# EAGLE design DoorLock (EAGLE 5.06)
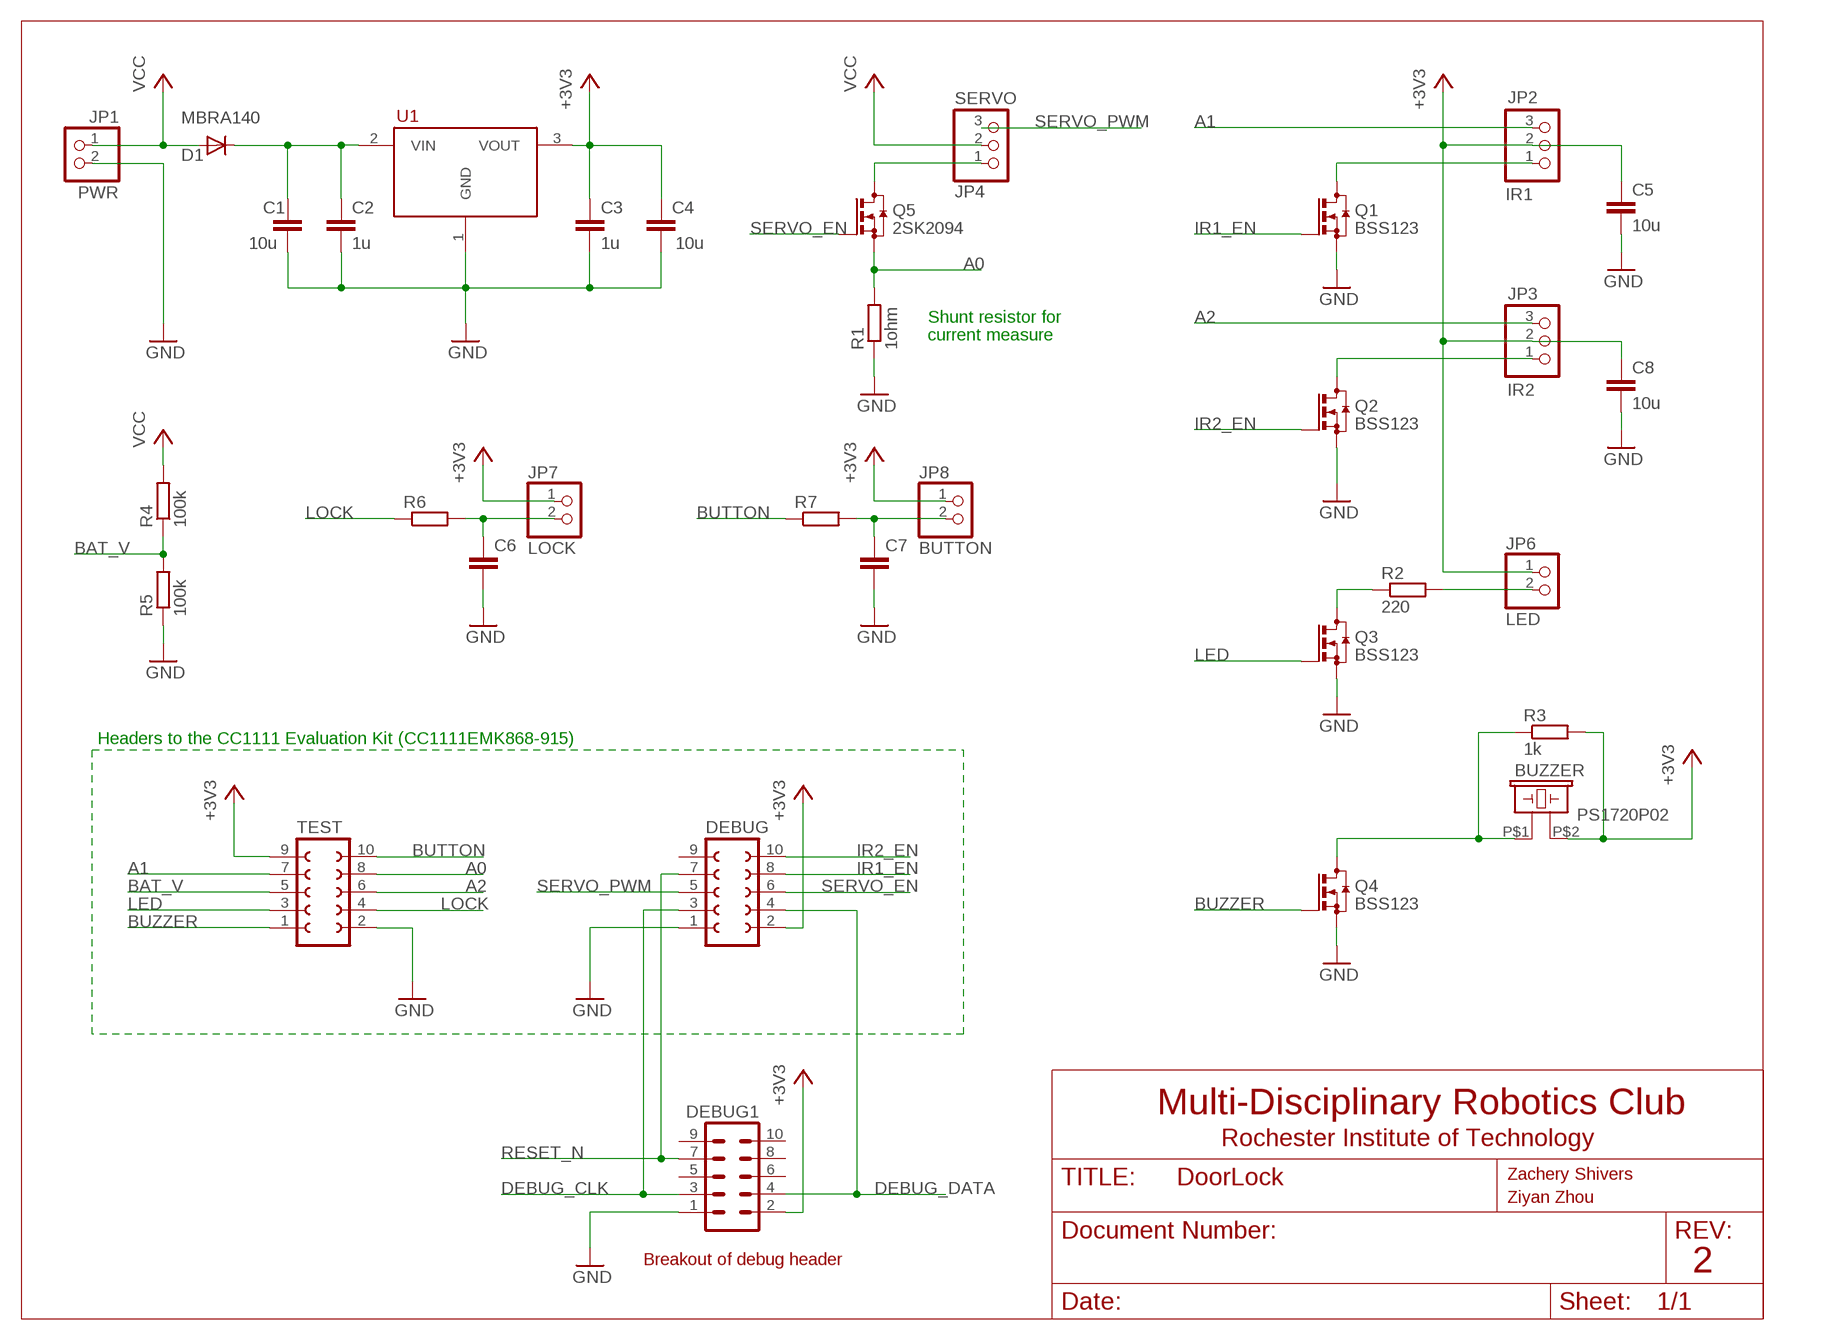
[diagram p0: schematic, sheet 1]

## Parts
BUZZER  PS1720P02  [PS1720P02]
C1  10u  C-EUC1210  [C1210]
C2  1u  C-EUC0805  [C0805]
C3  1u  C-EUC0805  [C0805]
C4  10u  C-EUC1210  [C1210]
C5  10u  C-EUC1210  [C1210]
C6  C-EUC0805  [C0805]
C7  C-EUC0805  [C0805]
C8  10u  C-EUC1210  [C1210]
D1  MBRA140  DIODESMA  [SMA-DIODE]
DEBUG  FE05-2  [FE05-2]
DEBUG1  MA05-2  [MA05-2]
JP1  PWR  PINHD-1X2  [1X02]
JP2  IR1  PINHD-1X3  [1X03]
JP3  IR2  PINHD-1X3  [1X03]
JP4  SERVO  PINHD-1X3  [1X03]
JP6  LED  PINHD-1X2  [1X02]
JP7  LOCK  PINHD-1X2  [1X02]
JP8  BUTTON  PINHD-1X2  [1X02]
Q1  BSS123  [SOT23]
Q2  BSS123  [SOT23]
Q3  BSS123  [SOT23]
Q4  BSS123  [SOT23]
Q5  2SK2094  [TO-252]
R1  1ohm  R-EU_  [5W-RESISTOR]
R2  220  R-EU_R0805  [R0805]
R3  1k  R-EU_R0805  [R0805]
R4  100k  R-EU_R0805  [R0805]
R5  100k  R-EU_R0805  [R0805]
R6  R-EU_R0805  [R0805]
R7  R-EU_R0805  [R0805]
TEST  FE05-2  [FE05-2]
U1  MCP1702  [TO92-]

## Nets
+3V3: BUZZER.P$2 C3.1 C4.2 C5.2 C8.2 DEBUG1.2 DEBUG.2 JP2.2 JP3.2 JP6.1 JP7.1 JP8.1 R3.2 TEST.9 U1.3(VOUT)
A0: Q5.3(S) R1.2 TEST.8
A1: JP2.3 TEST.7
A2: JP3.3 TEST.6
BAT_V: R4.1 R5.2 TEST.5
BUTTON: R7.1 TEST.10
BUZZER: Q4.1(G) TEST.1
DEBUG_CLK: DEBUG1.3 DEBUG.3
DEBUG_DATA: DEBUG1.4 DEBUG.4
GND: C1.1 C2.2 C3.2 C4.1 C5.1 C6.2 C7.2 C8.1 DEBUG1.1 DEBUG.1 JP1.2 Q1.2(S) Q2.2(S) Q3.2(S) Q4.2(S) R1.1 R5.1 TEST.2 U1.1(GND)
IR1_EN: DEBUG.8 Q1.1(G)
IR2_EN: DEBUG.10 Q2.1(G)
LED: Q3.1(G) TEST.3
LOCK: R6.1 TEST.4
N$1: JP4.1 Q5.2(D)
N$3: JP2.1 Q1.3(D)
N$5: C1.2 C2.1 D1.C U1.2(VIN)
N$7: JP3.1 Q2.3(D)
N$8: C7.1 JP8.2 R7.2
N$9: JP6.2 R2.2
N$10: Q3.3(D) R2.1
N$11: C6.1 JP7.2 R6.2
N$12: BUZZER.P$1 Q4.3(D) R3.1
RESET_N: DEBUG1.7 DEBUG.7
SERVO_EN: DEBUG.6 Q5.1(G)
SERVO_PWM: DEBUG.5 JP4.3
VCC: D1.A JP1.1 JP4.2 R4.2
Unconnected: DEBUG1.5 DEBUG1.6 DEBUG1.8 DEBUG1.9 DEBUG1.10 DEBUG.9

## Notes on the sheet
- Shunt resistor for
- current measure
- Headers to the CC1111 Evaluation Kit (CC1111EMK868-915)
- Multi-Disciplinary Robotics Club
- Rochester Institute of Technology
- Zachery Shivers
- Ziyan Zhou
- Breakout of debug header
- 2

## Library data of the parts
BUZZER = buzzer:PS1720P02
C1-C8 = resistor:C-EU: CAPACITOR, European symbol
D1 = SparkFun-Nate:DIODE
DEBUG TEST = con-lsta:FE05-2: FEMALE HEADER
DEBUG1 = con-lstb:MA05-2: PIN HEADER
JP1 JP6-JP8 = pinhead:PINHD-1X2: PIN HEADER
JP2-JP4 = pinhead:PINHD-1X3: PIN HEADER
Q1-Q4 = transistor-small-signal:BSS123: N-CHANNEL MOS FET
Q5 = doorlock-parts:2SK2094: N-CHANNEL MOS FET
R1 = doorlock-parts:R-EU_: RESISTOR, European symbol
R2-R7 = resistor:R-EU_: RESISTOR, European symbol
U1 = doorlock-parts:MCP1702

## Board
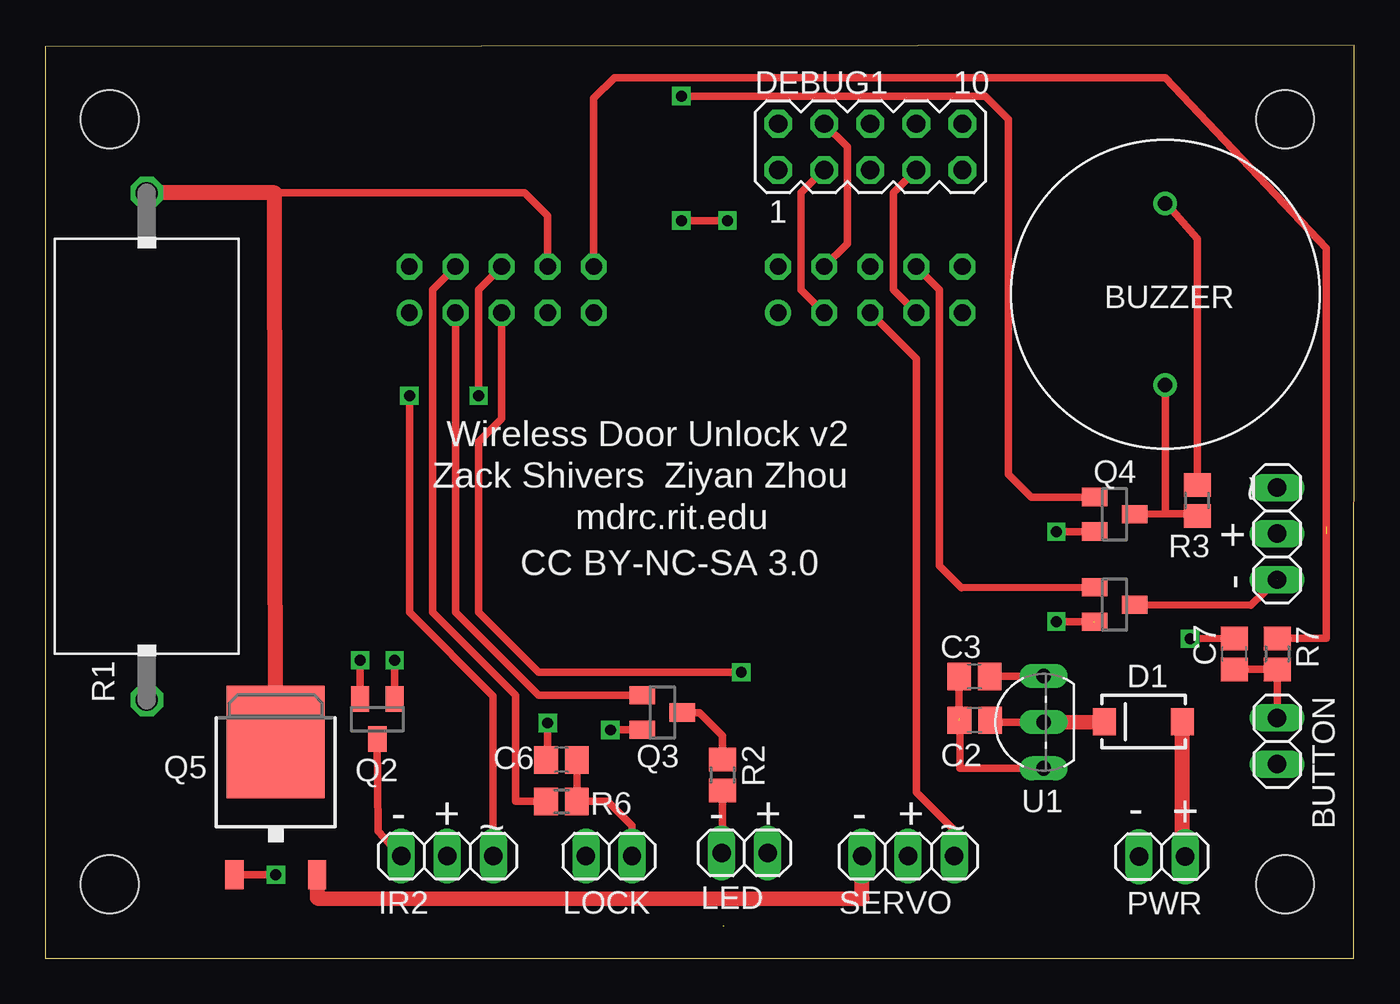
[diagram p1: board, top side]
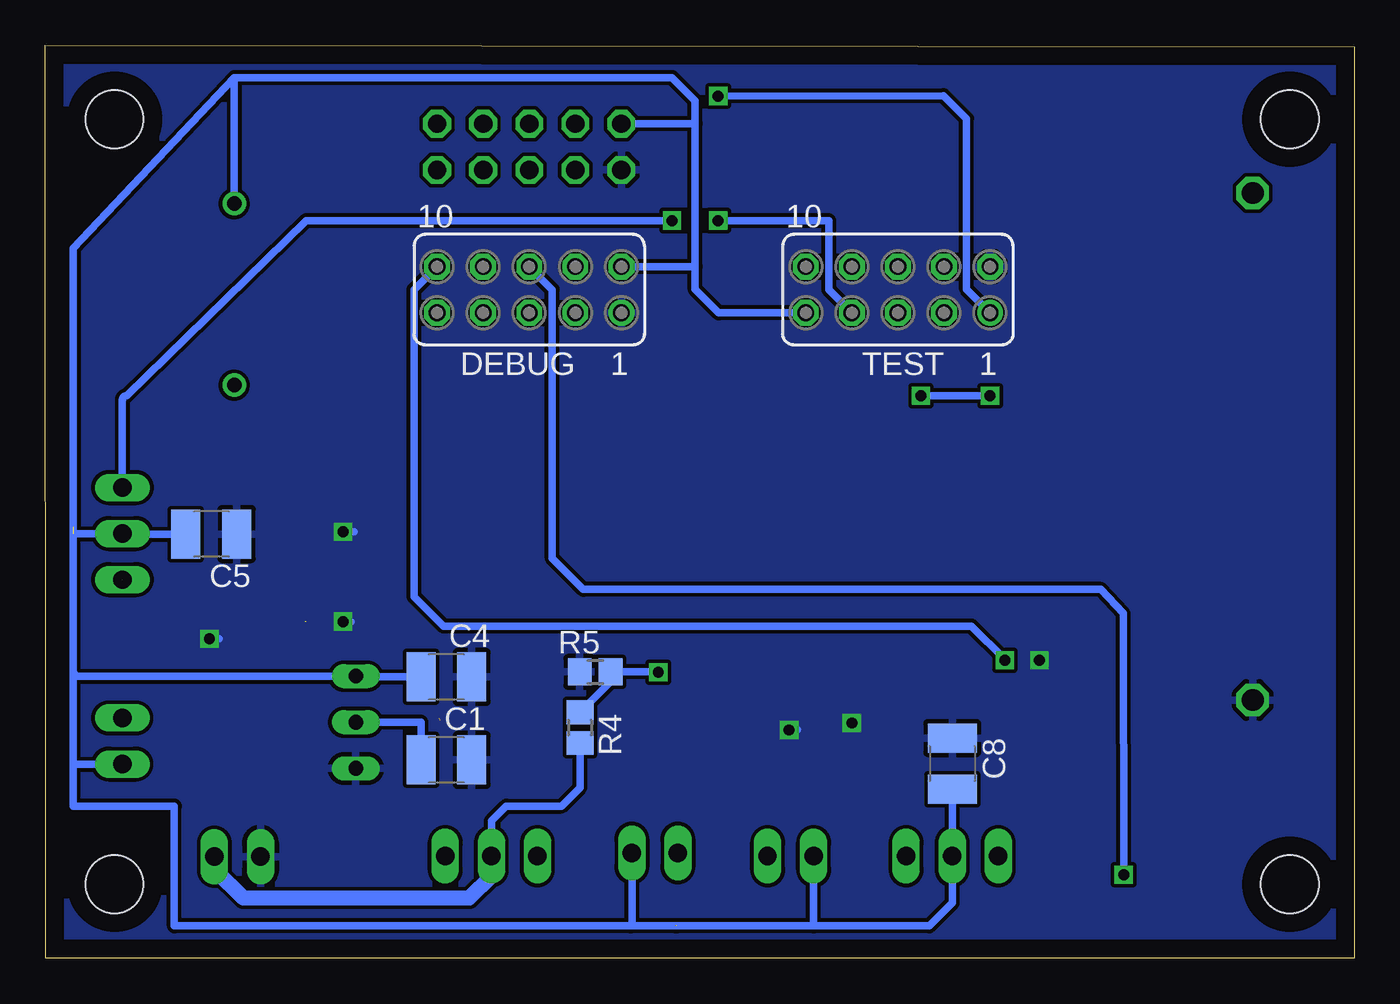
[diagram p2: board, bottom side, seen from below]

Size 72.14 x 50.29 mm. Coordinates in mm from the lower left corner, seen from the top.
Outline: 0,0 72.12,0 72.14,50.29 0,50.22 0,0
Copper layers (1*16): Top 0.035mm / dielectric 1.5mm / Bottom 0.035mm
Design rules "default *": minimum track width 10mil, minimum drill 12mil, track to track 8mil, track to pad 8mil, pad to pad 8mil, via to via 8mil, smd to smd 8mil, copper to edge 40mil, drill to drill 8mil, minimum pad ring 10mil, minimum via ring 8mil, stop-mask expansion 4mil, vias tented up to drill 0mil, thermal gap 10mil
Holes 3.2 mm at 68.33,4.06 68.33,46.23 3.56,46.23 3.56,4.06

### Footprints (pad centres in the part's own frame; a part is rotated, then mirrored left to right if it is on the bottom)
PS1720P02 = drill 0.8 round: P$1 -5,0; P$2 5,0
C1210 = smd 1.6 x 2.7: 1 -1.4,0; 2 1.4,0
C0805 = smd 1.3 x 1.5: 1 -0.85,0; 2 0.85,0
SMA-DIODE = smd 1.27 x 1.47: A -2.15,0; C 2.15,0
FE05-2 = drill 0.914 round: 1 -5.08,1.27 | drill 0.914 octagon: 2 -5.08,-1.27; 3 -2.54,1.27; 4 -2.54,-1.27; 5 0,1.27; 6 0,-1.27; 7 2.54,1.27; 8 2.54,-1.27; 9 5.08,1.27; 10 5.08,-1.27
MA05-2 = drill 1.016 octagon: 1 -5.08,-1.27; 2 -5.08,1.27; 3 -2.54,-1.27; 4 -2.54,1.27; 5 0,-1.27; 6 0,1.27; 7 2.54,-1.27; 8 2.54,1.27; 9 5.08,-1.27; 10 5.08,1.27
1X02 = drill 1.016 long: 1 -1.27,0; 2 1.27,0
1X03 = drill 1.016 long: 1 -2.54,0; 2 0,0; 3 2.54,0
SOT23 = smd 1 x 1.4: 1 -0.95,-1.1; 2 0.95,-1.1; 3 0,1.1
TO-252 = smd 1 x 1.6: 1 -2.28,-6.07; 2 2.28,-6.07 | smd 5.4 x 6.2: 3 0,1.23
5W-RESISTOR = drill 1.194 octagon: 1 -13.97,0; 2 13.97,0
R0805 = smd 1.3 x 1.5: 1 -0.85,0; 2 0.85,0
TO92- = drill 0.813 long: 1 -2.54,0; 2 0,0; 3 2.54,0

### Placement (x,y rotation side)
BUZZER  61.72,36.58 90 top
C1  50.04,10.92 180 bottom
C2  51.23,13.11 180 top
C3  51.21,15.52 180 top
C4  50.04,15.49 180 bottom
C5  62.99,23.37 180 bottom
C6  28.45,10.92 180 top
C7  65.53,16.76 90 top
C8  22.15,10.72 270 bottom
D1  60.53,13.03 180 top
DEBUG  45.47,36.83 180 bottom
DEBUG1  45.47,44.7 0 top
JP1  61.55,5.59 180 top
JP2  67.89,23.39 90 top
JP3  22.15,5.62 0 top
JP4  47.55,5.62 0 top
JP6  38.54,5.8 180 top
JP7  31.06,5.62 0 top
JP8  67.89,11.96 90 top
Q1  58.93,19.48 270 top
Q2  18.3,13.18 180 top
Q3  34.01,13.53 270 top
Q4  58.93,24.46 270 top
Q5  12.7,10.67 0 top
R1  5.59,28.19 90 top
R2  37.32,10.09 270 top
R3  63.49,25.22 90 top
R4  42.67,12.7 270 bottom
R5  41.83,15.77 0 bottom
R6  28.45,8.64 0 top
R7  67.89,16.76 270 top
TEST  25.15,36.83 180 bottom
U1  55.02,13 90 top

### Tracks (layer width: path | path; a pad name or v marks a point on that pad's centre or on a via)
+3V3  (2 unrouted)
  Top 0.406: U1.3 52.08,15.54 C3.1 | R3.2 63.5,39.62 61.72,41.66 BUZZER.P$2
  Bottom 0.406: 61.72,48.51 BUZZER.P$2 | 61.72,48.51 37.59,48.51 36.32,47.24 36.32,45.97 | 70.61,15.75 70.61,23.77 | 29.79,1.78 23.42,1.78 22.15,3.05 JP3.2 C8.2 | 29.79,1.78 JP7.1 | 29.79,1.78 37.34,1.78 | 37.4,1.78 39.88,1.78 | 39.88,1.78 65.02,1.78 65.02,8.38 70.61,8.38 70.61,10.67 | 70.61,10.67 70.61,15.75 | 70.61,15.75 70.4,15.54 U1.3 55.02,15.49 C4.2 | 61.72,48.51 70.61,39.12 70.61,23.39 JP2.2 67.86,23.37 C5.2 | JP8.1 70.59,10.69 70.61,10.67 | TEST.9 35.03,35.56 36.32,36.85 36.32,38.1 | 36.32,38.1 DEBUG.2 | JP6.1 39.81,1.84 39.88,1.78 | 36.32,38.1 36.32,45.97 | 36.32,45.97 DEBUG1.2
A0
  Top 0.406: Q5.3 11.18,11.18 12.95,11.18 | 12.65,42.16 26.42,42.16 27.69,40.89 TEST.8
  Top 0.813: R1.2 12.65,42.16 Q5.3
A1  (via drill 0.6)
  Top 0.406: v35.05,40.64 v37.59,40.64
  Bottom 0.406: v37.59,40.64 57.75,40.64 67.66,30.99 arc-90 67.89,30.76 JP2.3 | v35.05,40.64 28.96,40.64 28.96,36.83 TEST.7
A2  (via drill 0.6)
  Top 0.406: 24.64,5.62 JP3.3 24.69,14.43 20.07,19.05 v20.07,30.99 | TEST.6 23.88,36.83 v23.88,30.99
  Bottom 0.406: v20.07,30.99 v23.88,30.99
BAT_V  (via drill 0.6)
  Top 0.406: TEST.5 25.15,29.72 23.88,28.45 23.88,19.05 27.18,15.75 v38.35,15.75
  Bottom 0.406: R4.1 40.98,15.24 R5.2 38.38,15.77 v38.35,15.75
BUTTON
  Top 0.406: TEST.10 30.23,47.38 31.36,48.51 61.72,48.51 70.61,39.12 70.61,17.61 R7.1
BUZZER  (via drill 0.6)
  Top 0.406: v35.05,47.5 51.82,47.5 53.09,46.23 53.09,26.67 54.36,25.4 57.75,25.4 Q4.1
  Bottom 0.406: v35.05,47.5 22.63,47.52 21.36,46.25 21.36,36.85 TEST.1
DEBUG_CLK
  Top 0.406: DEBUG.3 41.66,36.83 41.66,42.16 DEBUG1.3
DEBUG_DATA
  Top 0.406: DEBUG.4 44.2,39.37 44.2,44.7 DEBUG1.4
GND  (via drill 0.6)  (2 unrouted)
  Top 0.406: C3.2 50.36,13.89 C2.2 | Q4.2 57.84,23.5 v55.73,23.5 | v63.09,17.6 C7.2 | v55.73,18.54 57.76,18.54 | U1.1 50.39,10.46 50.39,13.21 | Q2.2 | Q2.2 v17.35,16.41 | C6.2 27.69,11.01 v27.69,12.95 | v31.14,12.57 31.9,12.58 Q3.2
  Bottom 0.406: v55.73,23.5 55.12,23.5 | v31.14,12.57 30.68,12.57 | v63.09,17.6 62.56,17.6 | v55.73,18.54 55.3,18.54 | v27.69,12.95 27.69,13.21
  pour Bottom: 0.25,0.25 0.25,50.04 71.88,50.04 71.88,0.25
IR1_EN
  Top 0.406: DEBUG.8 49.28,36.83 49.28,21.61 50.48,20.41 Q1.1
IR2_EN  (via drill 0.6)
  Top 0.406: v19.25,16.41 v19.25,16.4 Q2.1
  Bottom 0.406: DEBUG.10 51.82,36.83 51.82,19.91 50.19,18.29 21.08,18.29 19.25,16.46 v19.25,16.41
LED
  Top 0.406: TEST.3 22.61,19.06 27.18,14.49 27.18,14.48 32,14.48 Q3.1
LOCK
  Top 0.406: TEST.4 21.34,36.83 21.34,19.05 25.91,14.48 25.91,8.64 R6.1
N$1
  Top 0.813: Q5.2 14.98,3.3 45.01,3.28 JP4.1
N$3  (1 unrouted)
  Top 0.406: Q1.3 66.44,19.45 JP2.1
N$5
  Top 0.406: U1.2 52.48,13 C2.1
  Top 0.813: U1.2 D1.C
  Bottom 0.406: C1.2 51.43,13 U1.2
N$7
  Top 0.406: JP3.1 18.34,7 Q2.3
N$8
  Top 0.406: JP8.2 R7.2 C7.1
N$9
  Top 0.406: R2.2 37.32,5.8 JP6.2
N$10
  Top 0.406: 37.34,11.2 R2.1 37.32,12.26 36.05,13.53 Q3.3
N$11
  Top 0.406: C6.1 R6.2 30.99,8.64 32.33,7.29 JP7.2
N$12
  Top 0.406: Q4.3 61.72,24.49 | 61.72,24.49 BUZZER.P$1 | 61.72,24.49 63.49,24.49 R3.1
RESET_N
  Top 0.406: DEBUG.7 46.74,36.83 46.74,42.16 DEBUG1.7
SERVO_EN  (via drill 0.6)
  Top 0.406: v12.7,4.6 Q5.1
  Bottom 0.406: DEBUG.6 44.2,36.83 44.2,22.02 42.49,20.32 13.95,20.32 12.72,18.99 v12.7,4.6
SERVO_PWM
  Top 0.406: DEBUG.5 48.01,33.02 48.01,9.14 50,7.15 50,5.62 JP4.3
VCC
  Top 0.813: D1.A 62.68,5.73 JP1.1
  Bottom 0.406: R4.2 42.67,9.4 43.69,8.38 46.74,8.38 47.55,7.56 JP4.2
  Bottom 0.813: JP4.2 47.55,4.52 48.77,3.3 61.21,3.3 62.74,4.83 62.74,5.51 JP1.1

### Text on the board
tNames: Wireless Door Unlock v2 | Zack Shivers Ziyan Zhou | ~ | mdrc.rit.edu | + | CC BY-NC-SA 3.0 | - | - | + | - | + | - | + | - | + | ~ | ~